# EAGLE design MLX90393 (EAGLE 9.6.2)
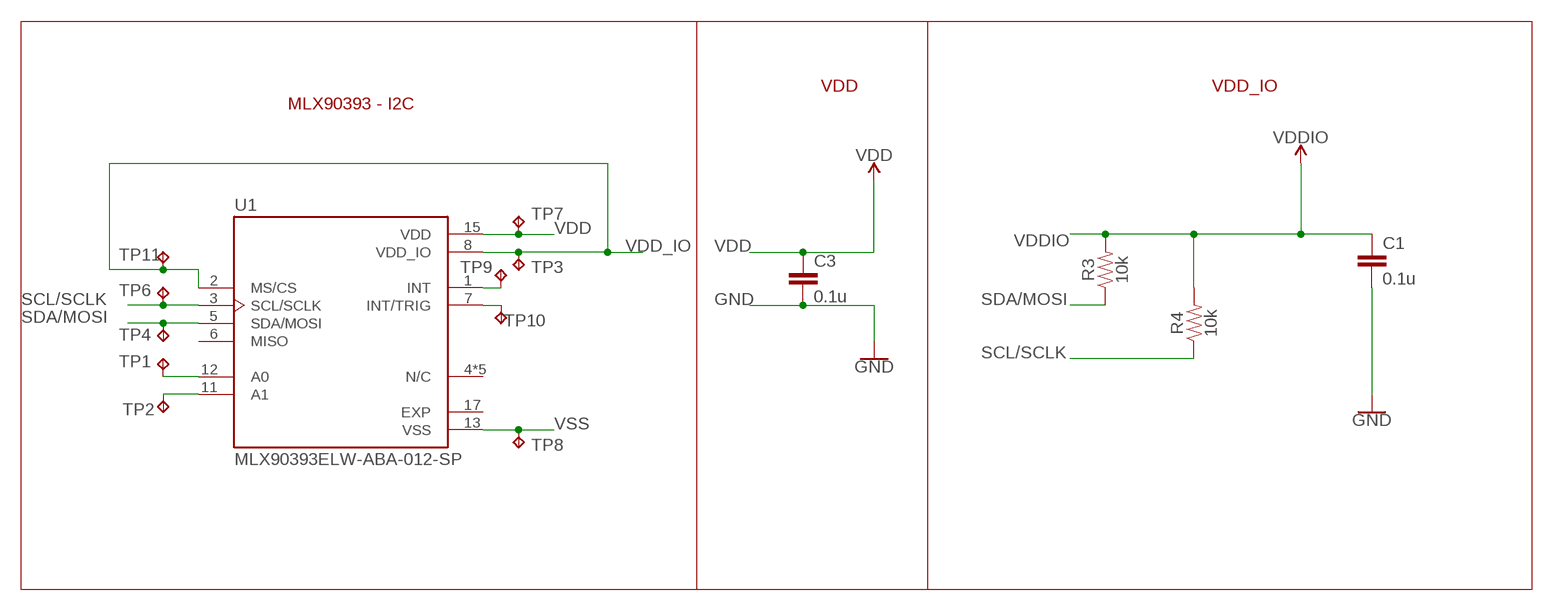
[diagram p0: schematic, sheet 1]

## Parts
C1  0.1u  CAP-1206  [1206]
C3  0.1u  CAP-1206  [1206]
R3  10k  RESISTOR1206  [1206]
R4  10k  RESISTOR1206  [1206]
TP1  TPB1,27  [B1,27]
TP2  TPB1,27  [B1,27]
TP3  TPB1,27  [B1,27]
TP4  TPB1,27  [B1,27]
TP6  TPB1,27  [B1,27]
TP7  TPB1,27  [B1,27]
TP8  TPB1,27  [B1,27]
TP9  TPB1,27  [B1,27]
TP10  TPB1,27  [B1,27]
TP11  TPB1,27  [B1,27]
U1  MLX90393ELW-ABA-012-SP  [QFN50P300X300X100-17N]

## Nets
GND: C1.2 C3.2
N$2: TP1.TP U1.12(A0)
N$3: TP2.TP U1.11(A1)
N$7: TP9.TP U1.1(INT)
N$8: TP10.TP U1.7(INT/TRIG)
SCL/SCLK: R4.1 TP6.TP U1.3(SCL/SCLK)
SDA/MOSI: R3.1 TP4.TP U1.5(SDA/MOSI)
VDD: C3.1 TP7.TP U1.15(VDD)
VDD_IO: TP3.TP TP11.TP U1.2(MS/CS) U1.8(VDD_IO)
VDDIO: C1.1 R3.2 R4.2
VSS: TP8.TP U1.13(VSS)
Unconnected: U1.4(N/C) U1.6(MISO) U1.9(N/C) U1.10(N/C) U1.14(N/C) U1.16(N/C) U1.17(EXP)

## Notes on the sheet
- VDD | VDD_IO
- MLX90393 - I2C

## Library data of the parts
C1 C3 = SparkFun-Capacitors:CAP
R3 R4 = SparkFun-Resistors:RESISTOR: Generic Resistor Package
TP1-TP4 TP6-TP11 = testpad:TP: Test pad
U1 = MLX90393ELW-ABA-012-SP:MLX90393ELW-ABA-012-SP: Check availability <https://pricing.snapeda.com/parts/MLX90393ELW-ABA-012-SP/Melexis/view-part?ref=eda>; AVAILABILITY: In Stock; CHECK_PRICES: https://www.snapeda.com/parts/MLX90393ELW-ABA-012-SP/Melexis/view-part/?ref=eda; DESCRIPTION: Triaxis Magnetic Node - I2C_address 0x04h (Gen.III); MF: Melexis; MP: MLX90393ELW-ABA-012-SP; PACKAGE: QFN-16-17 Melexis; PRICE: None; SNAPEDA_LINK: https://www.snapeda.com/parts/MLX90393ELW-ABA-012-SP/Melexis/view-part/?ref=snap

## Board
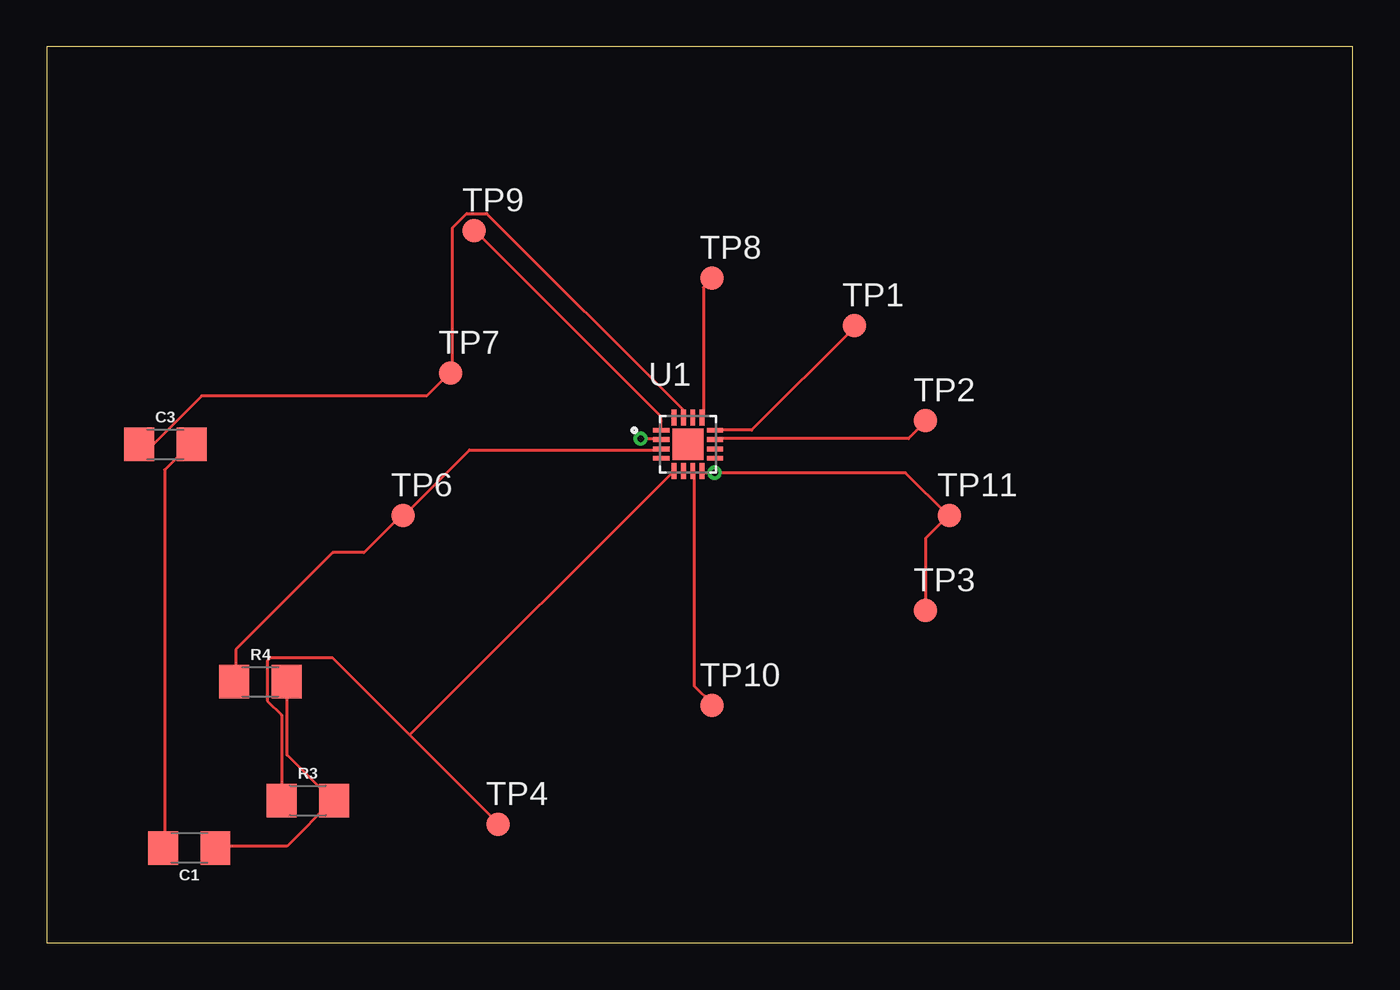
[diagram p1: board, top side]
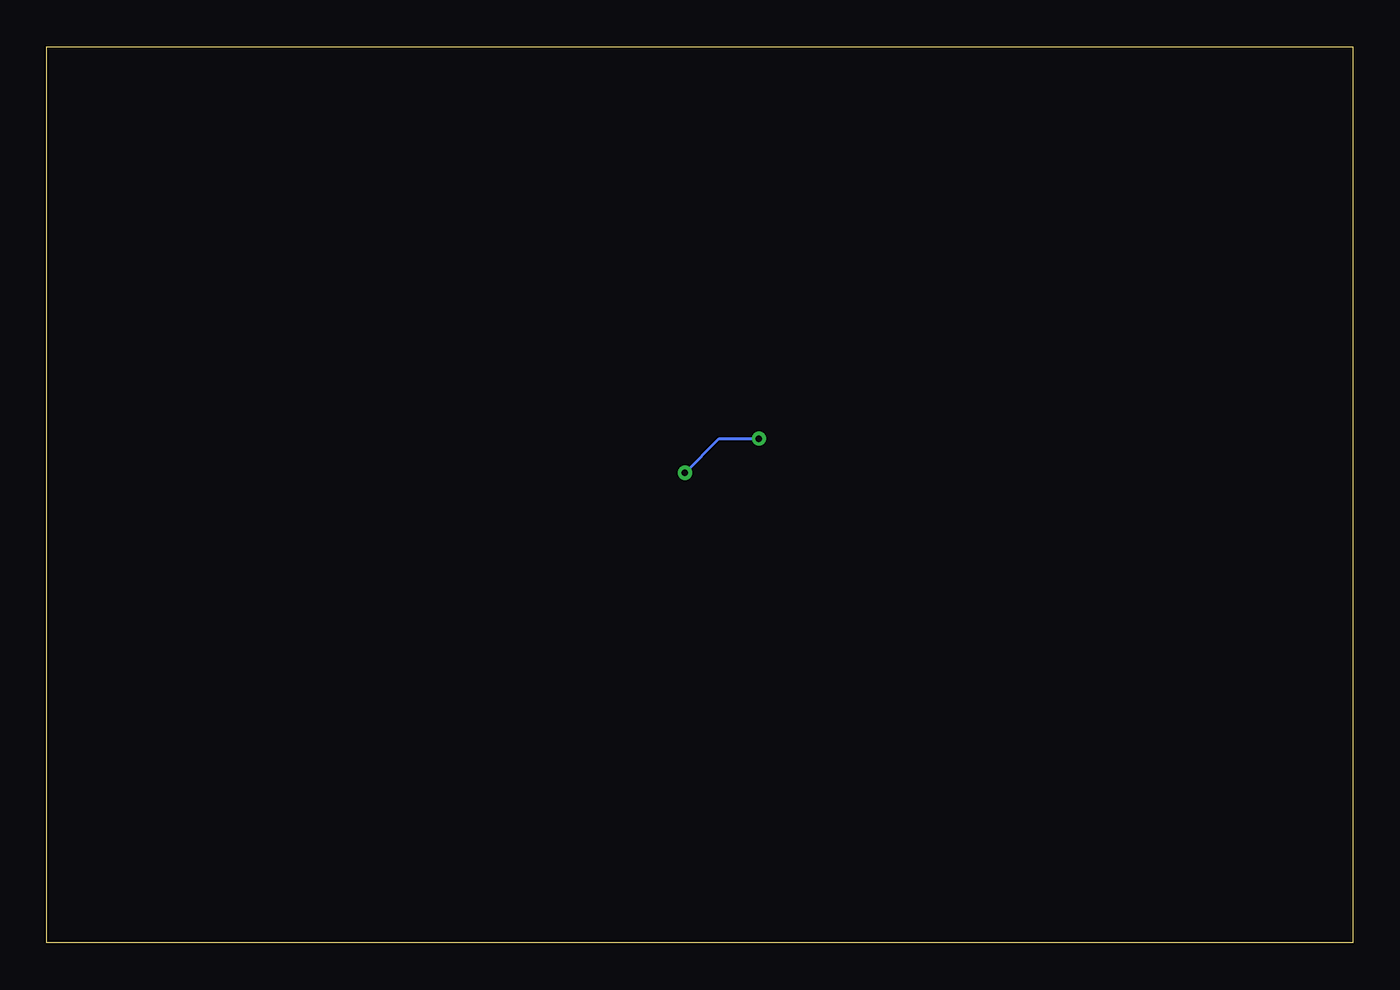
[diagram p2: board, bottom side, seen from below]

Size 69.83 x 47.93 mm. Coordinates in mm from the lower left corner, seen from the top.
Outline: 0,0 69.83,0 69.83,47.93 0,47.93 0,0
Copper layers (1*16): Top 0.035mm / dielectric 1.5mm / Bottom 0.035mm
Design rules "default": minimum track width 6mil, minimum drill 0.35mm, track to track 6mil, track to pad 6mil, pad to pad 6mil, via to via 6mil, smd to smd 6mil, copper to edge 40mil, drill to drill 6mil, minimum pad ring 10mil, minimum via ring 8mil, stop-mask expansion 4mil, vias tented up to drill 0mil, thermal gap 10mil

### Footprints (pad centres in the part's own frame; a part is rotated, then mirrored left to right if it is on the bottom)
1206 = smd 1.6 x 1.8: 1 -1.4,0; 2 1.4,0
B1,27 = smd 1.27 x 1.27: TP 0,0
QFN50P300X300X100-17N = smd 0.86 x 0.26: 1 -1.435,0.75; 2 -1.435,0.25; 3 -1.435,-0.25; 4 -1.435,-0.75; 9 1.435,-0.75; 10 1.435,-0.25; 11 1.435,0.25; 12 1.435,0.75 | smd 0.26 x 0.86: 5 -0.75,-1.435; 6 -0.25,-1.435; 7 0.25,-1.435; 8 0.75,-1.435; 13 0.75,1.435; 14 0.25,1.435; 15 -0.25,1.435; 16 -0.75,1.435 | smd 1.675 x 1.675: 17 0,0

### Placement (x,y rotation side)
C1  7.62,5.08 180 top
C3  6.35,26.67 0 top
R3  13.97,7.62 0 top
R4  11.43,13.97 0 top
TP1  43.18,33.02 0 top
TP2  46.99,27.94 0 top
TP3  46.99,17.78 0 top
TP4  24.13,6.35 0 top
TP6  19.05,22.86 0 top
TP7  21.59,30.48 0 top
TP8  35.56,35.56 0 top
TP9  22.86,38.1 0 top
TP10  35.56,12.7 0 top
TP11  48.26,22.86 0 top
U1  34.29,26.67 0 top

### Tracks (layer width: path | path; a pad name or v marks a point on that pad's centre or on a via)
GND
  Top 0.152: C1.2 6.3,5.18 6.3,25.3 7.67,26.67 C3.2
N$2
  Top 0.152: U1.12 35.87,27.43 37.69,27.43 43.18,32.92 TP1.TP
N$3
  Top 0.152: U1.11 35.87,26.98 46.08,26.98 46.99,27.89 TP2.TP
N$7
  Top 0.152: U1.1 32.82,27.43 32.82,28.19 22.91,38.1 TP9.TP
N$8
  Top 0.152: U1.7 34.65,25.15 34.65,13.72 35.56,12.8 TP10.TP
SCL/SCLK
  Top 0.152: U1.3 32.82,26.37 22.61,26.37 19.1,22.86 TP6.TP 18.95,22.86 16.97,20.88 15.29,20.88 10.11,15.7 10.11,14.02 R4.1
SDA/MOSI
  Top 0.152: 19.41,11.12 24.13,6.4 TP4.TP | 19.41,11.12 33.43,25.15 U1.5 | 19.41,11.12 15.29,15.24 11.94,15.24 11.79,15.09 11.79,12.95 12.55,12.19 12.55,7.62 R3.1
VDD
  Top 0.152: U1.15 34.04,28.19 34.04,28.5 23.52,39.01 22.45,39.01 21.69,38.25 21.69,30.48 TP7.TP 21.54,30.48 20.32,29.26 8.28,29.26 5.69,26.67 C3.1
VDD_IO  (via drill 0.35)
  Top 0.152: 48.21,22.86 45.92,25.15 v35.71,25.15 35.1,25.15 U1.8 | v31.75,26.98 32.82,26.98 U1.2 | TP3.TP 46.99,21.64 48.21,22.86 | 48.21,22.86 TP11.TP
  Bottom 0.152: v31.75,26.98 33.88,26.98 v35.71,25.15
VDDIO
  Top 0.152: 15.29,7.62 12.85,5.18 9.04,5.18 C1.1 | 15.29,7.62 12.85,10.06 12.85,13.87 R4.2 | 15.29,7.62 R3.2
VSS
  Top 0.152: U1.13 35.1,28.19 35.1,35.05 35.56,35.51 TP8.TP